# Altium schematic sheet ETH-PHY_SGMII.SchDoc
size A4; CompanyName: Technische Hochschule Nürnberg Georg Simon Ohm; Organization: UltraZohm; Address1: Kesslerplatz 12; Address2: 90489 Nürnberg; Address3: GERMANY; SheetNumber: 33; SheetTotal: 36; Website: www.ultrazohm.com
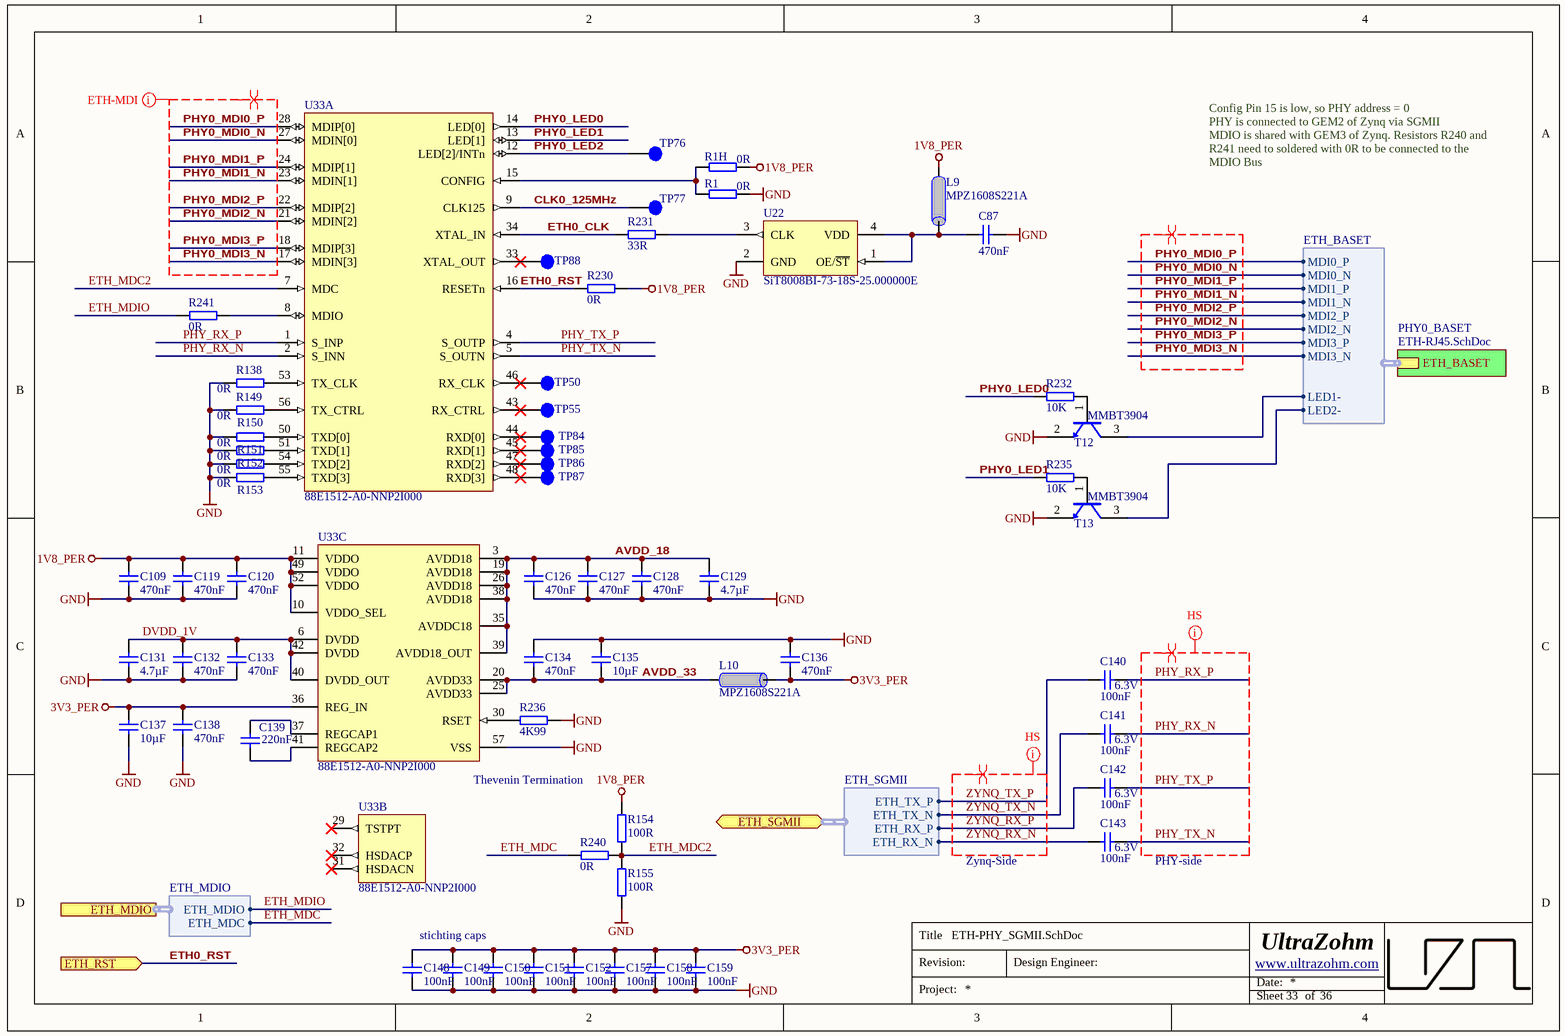
[diagram p0: ETH-PHY_SGMII.SchDoc]

## Parts
C87  470nF  [CAPC1608X90N_V]
C109  470nF  [CAPC1608X90N_V]
C119  470nF  [CAPC1608X90N_V]
C120  470nF  [CAPC1608X90N_V]
C126  470nF  [CAPC1608X90N_V]
C127  470nF  [CAPC1608X90N_V]
C128  470nF  [CAPC1608X90N_V]
C129  4.7µF  [CAPC1608X90N_V]
C131  4.7µF  [CAPC1608X90N_V]
C132  470nF  [CAPC1608X90N_V]
C133  470nF  [CAPC1608X90N_V]
C134  470nF  [CAPC1608X90N_V]
C135  10µF  [CAPC1608X90N_V]
C136  470nF  [CAPC1608X90N_V]
C137  10µF  [CAPC1608X90N_V]
C138  470nF  [CAPC1608X90N_V]
C139  220nF  [CAPC1608X90N_V]
C140  100nF  Voltage: 6.3V  [CAPC0603X33N_V]
C141  100nF  Voltage: 6.3V  [CAPC0603X33N_V]
C142  100nF  Voltage: 6.3V  [CAPC0603X33N_V]
C143  100nF  Voltage: 6.3V  [CAPC0603X33N_V]
C148  100nF  [CAPC0603X33N_V]
C149  100nF  [CAPC0603X33N_V]
C150  100nF  [CAPC0603X33N_V]
C151  100nF  [CAPC0603X33N_V]
C152  100nF  [CAPC0603X33N_V]
C157  100nF  [CAPC0603X33N_V]
C158  100nF  [CAPC0603X33N_V]
C159  100nF  [CAPC0603X33N_V]
L9  MPZ1608S221A  [INDC1608X95N_V]
L10  MPZ1608S221A  [INDC1608X95N_V]
R1  0R  [RESC1608X55N_V]
R1H  0R  [RESC1608X55N_V]
R138  0R  [RESC1608X55N_V]
R149  0R  [RESC1608X55N_V]
R150  0R  [RESC1608X55N_V]
R151  0R  [RESC1608X55N_V]
R152  0R  [RESC1608X55N_V]
R153  0R  [RESC1608X55N_V]
R154  100R  [RESC1608X55N_V]
R155  100R  [RESC1608X55N_V]
R230  0R  [RESC1608X55N_V]
R231  33R  [RESC1608X55N_V]
R232  10K  [RESC1608X55N_V]
R235  10K  [RESC1608X55N_V]
R236  4K99  [RESC1005X40N_V]
R240  0R  [RESC1608X55N_V]
R241  0R  [RESC1608X55N_V]
T12  MMBT3904  [SOT95P280X145-3N]
T13  MMBT3904  [SOT95P280X145-3N]
TP50  Testpoint 1mm  [TP_1mm]  (value not drawn)
TP55  Testpoint 1mm  [TP_1mm]  (value not drawn)
TP76  Testpoint 1mm  [TP_1mm]  (value not drawn)
TP77  Testpoint 1mm  [TP_1mm]  (value not drawn)
TP84  Testpoint 1mm  [TP_1mm]  (value not drawn)
TP85  Testpoint 1mm  [TP_1mm]  (value not drawn)
TP86  Testpoint 1mm  [TP_1mm]  (value not drawn)
TP87  Testpoint 1mm  [TP_1mm]  (value not drawn)
TP88  Testpoint 1mm  [TP_1mm]  (value not drawn)
U22  SiT8008BI-73-18S-25.000000E  [2016]
U33  88E1512-A0-NNP2I000  [QFN50P800X800X100-57N]  (parts A,B,C of 3)

## Sub-sheets
PHY0_BASET = ETH-RJ45.SchDoc: ETH_BASET (harness ETH_BASET)

## Ports
ETH_MDIO (harness ETH_MDIO), ETH_RST (in), ETH_SGMII (bidir, harness ETH_SGMII)

## Harnesses
ETH_SGMII: ETH_RX_N, ETH_RX_P, ETH_TX_N, ETH_TX_P
ETH_MDIO: ETH_MDC, ETH_MDIO
ETH_BASET: MDI0_P, MDI0_N, MDI1_P, MDI1_N, MDI2_P, MDI2_N, MDI3_P, MDI3_N, LED1-, LED2-

## Nets
1V8_PER: C109.1 C119.1 C120.1 L9.1 R1H.2 R154.2 R230.2 U33.10(VDDO_SEL) U33.11(VDDO) U33.49(VDDO) U33.52(VDDO)
3V3_PER: C136.2 C137.1 C138.1 C148.2 C149.2 C150.2 C151.2 C152.2 C157.2 C158.2 C159.2 L10.2 U33.36(REG_IN)
GND: C87.1 C109.2 C119.2 C120.2 C126.2 C127.2 C128.2 C129.2 C131.2 C132.2 C133.2 C134.1 C135.1 C136.1 C137.2 C138.2 C148.1 C149.1 C150.1 C151.1 C152.1 C157.1 C158.1 C159.1 R1.2 R138.1 R149.1 R150.1 R151.1 R152.1 R153.1 R155.1 R236.2 T12.2(EMITTER) T13.2(EMITTER) U22.2(GND) U33.57(VSS)
AVDD_18: C126.1 C127.1 C128.1 C129.1 U33.3(AVDD18) U33.19(AVDD18) U33.26(AVDD18) U33.35(AVDDC18) U33.38(AVDD18) U33.39(AVDD18_OUT)
AVDD_33: C134.2 C135.2 L10.1 U33.20(AVDD33) U33.25(AVDD33)
CLK0_125MHz: TP77.1 U33.9(CLK125)
DVDD_1V: C131.1 C132.1 C133.1 U33.6(DVDD) U33.40(DVDD_OUT) U33.42(DVDD)
ETH0_CLK: R231.1 U33.34(XTAL_IN)
ETH0_RST: R230.1 U33.16(RESETn) ; port ETH_RST
ETH_MDC: R240.1 ; port ETH_MDIO.ETH_MDC
ETH_MDC2: R154.1 R155.2 R240.2 U33.7(MDC)
ETH_MDIO: R241.1 ; port ETH_MDIO.ETH_MDIO
PHY0_LED0: R232.1 U33.14(LED[0])
PHY0_LED1: R235.1 U33.13(LED[1])
PHY0_LED2: TP76.1 U33.12(LED[2]/INTn)
PHY0_MDI0_N: U33.27(MDIN[0]) ; sheet PHY0_BASET/ETH_BASET.MDI0_N
PHY0_MDI0_P: U33.28(MDIP[0]) ; sheet PHY0_BASET/ETH_BASET.MDI0_P
PHY0_MDI1_N: U33.23(MDIN[1]) ; sheet PHY0_BASET/ETH_BASET.MDI1_N
PHY0_MDI1_P: U33.24(MDIP[1]) ; sheet PHY0_BASET/ETH_BASET.MDI1_P
PHY0_MDI2_N: U33.21(MDIN[2]) ; sheet PHY0_BASET/ETH_BASET.MDI2_N
PHY0_MDI2_P: U33.22(MDIP[2]) ; sheet PHY0_BASET/ETH_BASET.MDI2_P
PHY0_MDI3_N: U33.17(MDIN[3]) ; sheet PHY0_BASET/ETH_BASET.MDI3_N
PHY0_MDI3_P: U33.18(MDIP[3]) ; sheet PHY0_BASET/ETH_BASET.MDI3_P
PHY_RX_N: C141.2 U33.2(S_INN)
PHY_RX_P: C140.2 U33.1(S_INP)
PHY_TX_N: C143.2 U33.5(S_OUTN)
PHY_TX_P: C142.2 U33.4(S_OUTP)
ZYNQ_RX_N: C143.1 ; port ETH_SGMII.ETH_RX_N
ZYNQ_RX_P: C142.1 ; port ETH_SGMII.ETH_RX_P
ZYNQ_TX_N: C141.1 ; port ETH_SGMII.ETH_TX_N
ZYNQ_TX_P: C140.1 ; port ETH_SGMII.ETH_TX_P
NetC87_2: C87.2 L9.2 U22.1(OE/~{ST}) U22.4(VDD)
NetC139_1: C139.1 U33.37(REGCAP1)
NetC139_2: C139.2 U33.41(REGCAP2)
NetR1_1: R1.1 R1H.1 U33.15(CONFIG)
NetR138_2: R138.2 U33.53(TX_CLK)
NetR149_2: R149.2 U33.56(TX_CTRL)
NetR150_2: R150.2 U33.50(TXD[0])
NetR151_2: R151.2 U33.51(TXD[1])
NetR152_2: R152.2 U33.54(TXD[2])
NetR153_2: R153.2 U33.55(TXD[3])
NetR231_2: R231.2 U22.3(CLK)
NetR232_2: R232.2 T12.1(BASIS)
NetR235_2: R235.2 T13.1(BASIS)
NetR236_1: R236.1 U33.30(RSET)
NetR241_2: R241.2 U33.8(MDIO)
NetT12_3: T12.3(COLLECTOR) ; sheet PHY0_BASET/ETH_BASET.LED1-
NetT13_3: T13.3(COLLECTOR) ; sheet PHY0_BASET/ETH_BASET.LED2-
NetTP50_1: TP50.1 U33.46(RX_CLK)
NetTP55_1: TP55.1 U33.43(RX_CTRL)
NetTP84_1: TP84.1 U33.44(RXD[0])
NetTP85_1: TP85.1 U33.45(RXD[1])
NetTP86_1: TP86.1 U33.47(RXD[2])
NetTP87_1: TP87.1 U33.48(RXD[3])
NetTP88_1: TP88.1 U33.33(XTAL_OUT)

Not connected (* = marked no-connect by the designer): U33 29(TSTPT)* 31(HSDACN)* 32(HSDACP)*

## Layout directives
differential pair: PHY0_MDI0_N, PHY0_MDI0_P, PHY0_MDI1_N, PHY0_MDI1_P, PHY0_MDI2_N, PHY0_MDI2_P, PHY0_MDI3_N, PHY0_MDI3_P, PHY_RX_N, PHY_RX_P, PHY_TX_N, PHY_TX_P, ZYNQ_RX_N, ZYNQ_RX_P, ZYNQ_TX_N, ZYNQ_TX_P
net class ETH-MDI: PHY0_MDI0_N, PHY0_MDI0_P, PHY0_MDI1_N, PHY0_MDI1_P, PHY0_MDI2_N, PHY0_MDI2_P, PHY0_MDI3_N, PHY0_MDI3_P
net class HS: PHY_RX_N, PHY_RX_P, PHY_TX_N, PHY_TX_P, ZYNQ_RX_N, ZYNQ_RX_P, ZYNQ_TX_N, ZYNQ_TX_P

## Notes on the sheet
- Config Pin 15 is low, so PHY address = 0
  PHY is connected to GEM2 of Zynq via SGMII
  MDIO is shared with GEM3 of Zynq. Resistors R240 and R241 need to soldered with 0R to be connected to the MDIO Bus
- Thevenin Termination
- Zynq-Side
- (near C143) PHY-side
- stichting caps
- Title
- Revision:
- Design Engineer:
- Date:
- Project:
- Sheet
- of

## Library data of the parts
C87 C109 C119 C120 C126-C128 C132-C134 C136 C138 = 25476: KON 470nF 50V X7R SMD  BF 1608 (0603); Value: 470n; AN: 25476; Mixed: SMT; Preferred: Yes; Temperature-Range: -55/+125; Voltage: 50V; Technology: X7R; Case: 1608 (0603)
C129 C131 = 29699: KON 4.7µF 25V X5R 20%  SMD BF 1608 (0603); Value: 4.7u; AN: 29699; Mixed: SMT; Preferred: Yes; Temperature-Range: -55/+85; Tolerance: 20%; Voltage: 25V; Technology: X5R; Case: 1608 (0603)
C135 C137 = 22918: KON 10µF 6,3V X5R SMD BF 1608 (0603); Value: 10u; Voltage: 6.3V; AN: 22918; Mixed: SMT; Temperature-Range: -55/+85; Technology: X5R; Case: 1608 (0603)
C139 = 29694: KON 220nF 50V X7R ±10% SMD BF 1608 (0603); Value: 220n; AN: 29694; Mixed: SMT; Temperature-Range: -55/+125; Tolerance: ±10%; Voltage: 50V; Technology: X7R; Case: 1608 (0603)
C140-C143 C148-C152 C157-C159 = 24915: KON 100nF 6.3V X5R 10% SMD BF 0603 (0201); AN: 24915; Mixed: SMT; Value: 100n; Preferred: Yes; Temperature-Range: -55/+85; Technology: X5R; Case: 0603 (0201); Tolerance: 10%
  C148-C152 C157-C159: Voltage: 6.3V
L9 L10 = 22718: Ferritdurchführung MPZ1608S221A; Value: 220 OHm @ 100MHz; AN: 22718; Mixed: SMT; Trenz-Stock: Yes; Temperature-Range: -55/+125; Extra: 0,05 Ohm DC, 220 Ohm bei 100MHz. 2A; Case: 1608 (0603); HelpURL: B:\AD\adlib\datasheet\MPZ1608; Preferred: Yes; H-ART: MPZ1608S221A; Storage-Temperature: -55/+125
R1 R1H = 21491: WID SMD 0R 0,1W 1% TK100  BF 1608 (0603); AN: 21491; Mixed: SMT; Value: 0; Tolerance: 1%; Case: 1608 (0603); Technology: TK100
R138 R149-R153 R230 R240 R241 = 21491: WID SMD 0R 0,1W 1% TK100  BF 1608 (0603); Value: 0; AN: 21491; Mixed: SMT; Tolerance: 1%; Case: 1608 (0603); Technology: TK100
R154 R155 = 21380: WID SMD 100R 1% 0,1W BF 1608 (0603); Value: 100; AN: 21380; Mixed: SMT; Preferred: Yes; Tolerance: 1%; Case: 1608 (0603); Technology: TK100
R231 = 22430: WID SMD 33R 1% 0,1W; Value: 33; AN: 22430; Mixed: SMT; Extra: BF 1608 (0603); Tolerance: 1%; Case: 1608 (0603); Technology: TK100
R232 R235 = 21492: WID SMD 10K 1% 0,1W  BF 1608 (0603); AN: 21492; Mixed: SMT; Preferred: Yes; Value: 10K; Tolerance: 1%; Case: 1608 (0603); Technology: TK100
R236 = 22754: WID SMD 4K99 1% 0,063W BF 1005 (0402); AN: 22754; Mixed: SMT; Value: 4.99K; Preferred: Yes; H-ART: RC0402FR-074K99L; Tolerance: 1%; Case: 1005 (0402); Technology: TK100
T12 T13 = 23806: AN: 23806; Mixed: SMT; Trenz-Stock: Yes; Extra: NPN General Purpose Amplifier; Case: SOT23-3; HelpURL: B:\AD\adlib\datasheet\MMBT3904; Preferred: Yes; H-ART: MMBT3904
TP50 TP55 TP76 TP77 TP84-TP88 = 25063: AN: 25063; Mixed: SMT
U22 = 27228: SiT8008BI-73-18S-25.000000E MEMS Oszillator 25.000000MHz; Value: 25M; Voltage: 1.8V; AN: 27228; Mixed: SMT; Preferred: Yes; Temperature-Range: -40/+85; Extra: 1.8V , -40° C - 85° C , ±50 ppm , 2x1,6 mm; HelpURL: B:\AD\adlib\datasheet\SiT8008; Case: 2.0  x 1.6mm; H-ART: SIT8008BI-73-18S-25.000000E; Storage-Temperature: -65/+150 (Abs)
U33 = 24652: AN: 24652; Mixed: SMT; Trenz-Stock: Yes; Temperature-Range: -40/+85; Extra: Energy Efficient Gigabit Ethernet Transceiver, Industrial; Case: QFN56; HelpURL: B:\AD\adlib\datasheet\NDA\88E1512; Preferred: Yes; H-ART: 88E1512-A0-NNP2I000; Storage-Temperature: -55/+125 (Abs)